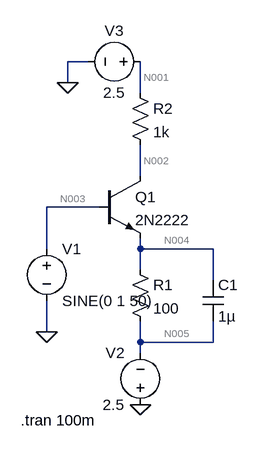
[diagram p0: schematic Draft2.asc]
Draft2.asc, the LTspice schematic file:
Version 4.1
SHEET 1 880 680
WIRE 112 -16 80 -16
WIRE 80 16 80 -16
WIRE 192 32 192 -16
WIRE 192 160 192 112
WIRE 128 208 48 208
WIRE 48 272 48 208
WIRE 192 272 192 256
WIRE 304 272 192 272
WIRE 192 304 192 272
WIRE 304 320 304 272
WIRE 48 400 48 352
WIRE 192 416 192 384
WIRE 304 416 304 384
WIRE 304 416 192 416
WIRE 192 432 192 416
FLAG 192 512 0
FLAG 48 400 0
FLAG 80 16 0
SYMBOL npn 128 160 R0
SYMATTR InstName Q1
SYMATTR Value 2N2222
SYMBOL res 176 288 R0
SYMATTR InstName R1
SYMATTR Value 100
SYMBOL cap 288 320 R0
SYMATTR InstName C1
SYMATTR Value 1µ
SYMBOL res 176 16 R0
SYMATTR InstName R2
SYMATTR Value 1k
SYMBOL voltage 48 256 R0
WINDOW 123 0 0 Left 0
WINDOW 39 0 0 Left 0
SYMATTR InstName V1
SYMATTR Value SINE(0 1 50)
SYMBOL voltage 192 528 R180
WINDOW 0 24 96 Left 2
WINDOW 3 24 16 Left 2
WINDOW 123 0 0 Left 0
WINDOW 39 0 0 Left 0
SYMATTR InstName V2
SYMATTR Value 2.5
SYMBOL voltage 208 -16 R90
WINDOW 0 -32 56 VBottom 2
WINDOW 3 32 56 VTop 2
WINDOW 123 0 0 Left 0
WINDOW 39 0 0 Left 0
SYMATTR InstName V3
SYMATTR Value 2.5
TEXT 8 536 Left 2 !.tran 100m

The netlist it stands for:
* Draft2.asc
Q1 N002 N003 N004 0 2N2222
R1 N004 N005 100
C1 N004 N005 1µ
R2 N001 N002 1k
V1 N003 0 SINE(0 1 50)
V2 0 N005 2.5
V3 N001 0 2.5
.model NPN NPN
.model PNP PNP
.lib standard.bjt
.tran 100m
.backanno
.end

* Results of the author's LTspice run, read from the files saved beside the schematic
* Operating Point, zero values left out:
*   V(n005) = -2.5 V
*   V(n001) = 2.5 V
*   V(n002) = -875 mV
*   V(n004) = -889.7 mV
*   Ic(Q1) = 3.375 mA
*   Ib(Q1) = 12.73 mA
*   Ie(Q1) = -16.1 mA
*   I(V1) = -12.73 mA
*   I(V2) = -16.1 mA
*   I(R2) = 3.375 mA
*   I(R1) = 16.1 mA
*   I(V3) = -3.375 mA
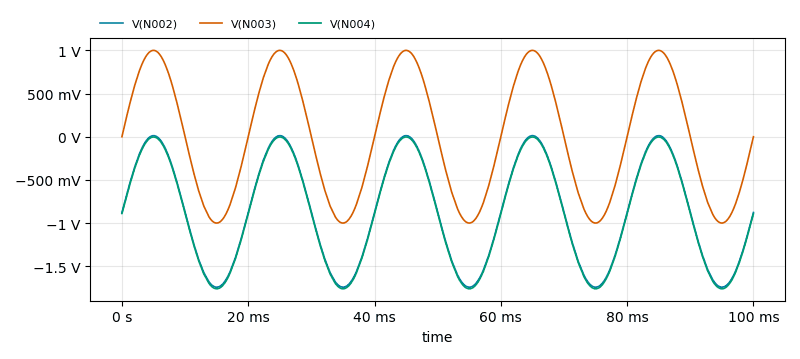
[diagram p1: Transient Analysis of Draft2.asc, plotted from the saved traces]
* Transient Analysis, 1 run:
*   V(N002): min -1.743 V, max 12.46 mV, average -870.1 mV, rms 1.07 V, last -878 mV
*   V(N003): min -1 V, max 1 V, average 465.1 µV, rms 708.1 mV, last 0 V
*   V(N004): min -1.761 V, max -3.244 mV, average -885.8 mV, rms 1.083 V, last -892.6 mV